# Altium schematic sheet booster_Circuit.SchDoc
size A; SheetNumber: 3; SheetTotal: 7
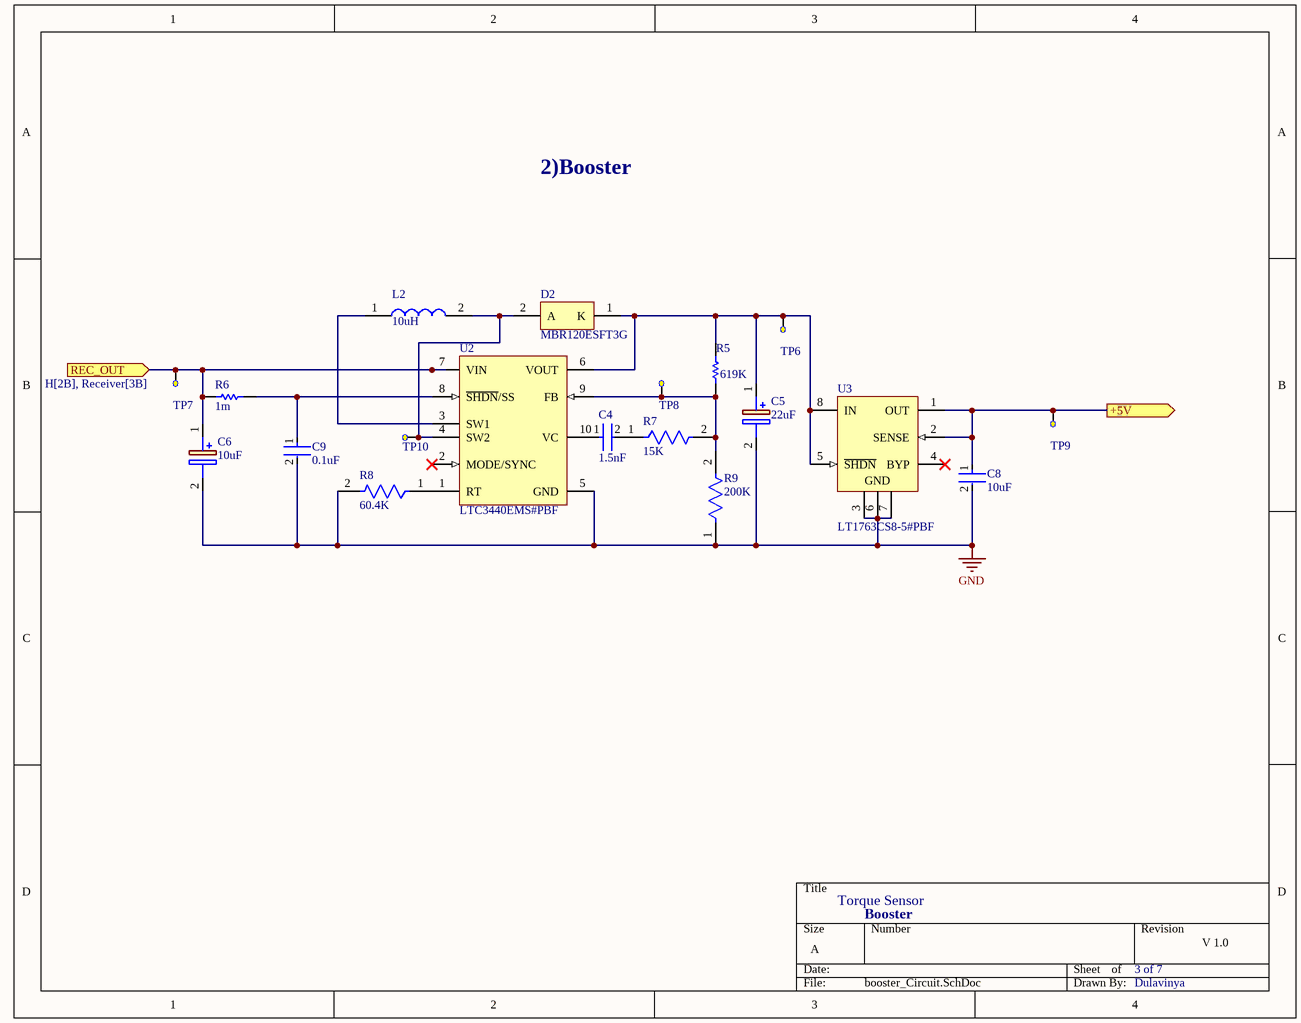
[diagram p0: booster_Circuit.SchDoc]

## Parts
C4  1.5nF  [FP-CC0402-MFG]
C5  22uF  [EEE1AA220WR]
C6  10uF  [EEE1AA220WR]
C8  10uF  [FP-GRM155-0_05-MFG]
C9  0.1uF  [FP-GRM155-0_05-MFG]
D2  MBR120ESFT3G  [ONSC-SOD-123FL-2-498_V]
L2  10uH  [INDM6552X200N]
R5  619K  [RESC1005X40X25ML05T05]
R6  1m  [RESC2013X60X35ML10T20]
R7  15K  [FP-RT0402-MFG]
R8  60.4K  [FP-ERJ2RK-MFG]
R9  200K  [FP-RT0402-MFG]
TP6  Test point  [Test_point]  (value not drawn)
TP7  Test point  [Test_point]  (value not drawn)
TP8  Test point  [Test_point]  (value not drawn)
TP9  Test point  [Test_point]  (value not drawn)
TP10  Test point  [Test_point]  (value not drawn)
U2  LTC3440EMS#PBF  [LT-MS-10_M]
U3  LT1763CS8-5#PBF  [LT-S8-8_M]

## Ports
+5V (out, see H[2B], Instrumentation_Amp[2B], MCU_1[1B], Offset[2B]), REC_OUT (in, see H[2B], Receiver[3B])

## Nets
GND: C5.2(-) C6.2(-) C8.2 C9.2 R8.2 R9.1 U2.5(GND) U3.3(GND) U3.6(GND) U3.7(GND)
+5V: C8.1 TP9.TP?(Test_point) U3.1(OUT) U3.2(SENSE) ; port +5V
REC_OUT: C6.1(+) R6.1 TP7.TP?(Test_point) U2.7(VIN) ; port REC_OUT
NetC4_1: C4.1 U2.10(VC)
NetC4_2: C4.2 R7.1
NetC5_1: C5.1(+) D2.1(K) R5.2 TP6.TP?(Test_point) U2.6(VOUT) U3.5(~{SHDN}) U3.8(IN)
NetC9_1: C9.1 R6.2 U2.8(~{SHDN}/SS)
NetD2_2: D2.2(A) L2.2 TP10.TP?(Test_point) U2.4(SW2)
NetL2_1: L2.1 U2.3(SW1)
NetR5_1: R5.1 R7.2 R9.2 TP8.TP?(Test_point) U2.9(FB)
NetR8_1: R8.1 U2.1(RT)

Not connected (* = marked no-connect by the designer): U2 2(MODE/SYNC)*; U3 4(BYP)*

## Notes on the sheet
- 2)Booster
- Torque Sensor
- Booster
- 3 of 7
- V 1.0
- Dulavinya

## Library data of the parts
C4 = CMP-03422-001237-1: CAP CER 1500PF 50V X7R 0402; Manufacturer: YAGEO; Manufacturer Part Number: CC0402KRX7R9BB152; Automotive Grade: NA; Temperature Coefficient: 30ppm/°C; Material: Ceramic; Tolerance: 0.1; Device Class L1: Passive Components; Temperature Range Low: -55°C; Digikey Description: CAP CER 1500PF 50V X7R 0402; Voltage Rating: 50 V; Temperature Range High: +125°C; Value: 1.5 nF; Ipc Land Pattern Name: CAPC10050X50; Footprint Url: http://www.yageo.com/exep/pages/download/literatures/UPY-C_GEN_24.pdf; RoHS: TRUE; Device Class L2: Capacitors; Height: 0.55mm; ComponentLink2Description: Datasheet; Mouser Description: Multilayer Ceramic Capacitors MLCC - SMD/SMT 1.5nF 50V X7R 10%; Octopart: https://octopart.com/cc0402krx7r9bb152-yageo-40952070; Temperature Characteristic: X7R; Temperature: -55°C to +125°C; Device Class L3: Ceramic Capacitors; Package: CC0402; ComponentLink2URL: http://www.yageo.com/documents/recent/UPY-GP_NP0_16V-to-50V_16.pdf; Capacitance: 1.5 nF; Automotive: No; Category: Cap; Lead Free: Yes
C5 C6 = EEE-FN1E220R: Capacitor Polarised; Manufacturer_Name: Panasonic; Datasheet Link: http://industrial.panasonic.com/cdbs/www-data/pdf/RDE0000/RDE0000C1259.pdf; Height: 5.5mm; Manufacturer_Part_Number: EEE-FN1E220R; Mouser Part Number: 667-EEE-FN1E220R; Mouser Price/Stock: https://www.mouser.co.uk/ProductDetail/Panasonic/EEE-FN1E220R?qs=OlC7AqGiEDmsrQfqs6SjTg%3D%3D
C8 C9 = CMP-2008-03928-2: NexarPartId: 9223238; Manufacturer Lifecycle Status: NRND; Voltage: 16V; Tolerance: 10%; Dielectric: X7R; Material: Ceramic; Capacitance: 100nF; Schedule B: 8532240020, 8532240020; Mount: Surface Mount; Case/Package: 0402; Case Code (Imperial): 0402; Min Operating Temperature: -55°C; Length: 1mm; Voltage Rating (DC): 16V; Depth: 500µm; Lead Free: Lead Free; Max Operating Temperature: 125°C; Case Code (Metric): 1005; Radiation Hardening: No; Height: 550µm; Voltage Rating: 16V; Packaging: Cut Tape; RoHS: Compliant; Width: 500µm; Number of Pins: 2; REACH SVHC: No SVHC; Termination: SMD/SMT; Thickness: 500µm
D2 = CMP-1055-00436-1: Schottky Power Rectifier, 2-Pin SOD-123, Pb-Free, Tape and Reel; Manufacturer: On Semiconductor; Configuration: Single; IFSM Max (A): 40; DatasheetVersion: Rev. 4; ComponentLink3URL: http://www.onsemi.com/pub_link/Collateral/498-01.PDF; Packing: Tape and Reel; PackageVersion: Rev. D, 05/2013; ComponentLink3Description: Package Specification; Mounting Technology: Surface Mount; ComponentLink2Description: Datasheet; PackageDescription: 2-Pin SOD, Body 1.65 x 2.7 mm; ComponentLink1Description: Manufacturer URL; ComponentLink2URL: http://www.onsemi.cn/pub_link/Collateral/MBR120ESFT1-D.PDF; ComponentLink1URL: http://www.onsemi.com/; PartNumber: MBR120ESFT3G; PackageReference: SOD-123FL-2-498; RoHS: TRUE
L2 = DO1606T-103MLC: Inductor; Manufacturer_Name: COILCRAFT; Datasheet Link: https://componentsearchengine.com/Datasheets/1/DO1606T-103MLC.pdf; Height: 2mm; Manufacturer_Part_Number: DO1606T-103MLC; Mouser Part Number: 994-DO1606T-103MLC; Mouser Price/Stock: https://www.mouser.co.uk/ProductDetail/Coilcraft/DO1606T-103MLC?qs=ZYnrCdKdyefGdFkruljUUQ%3D%3D
R5 = CMP-2002-01017-1: Part Number: ERJ-2RKF6193X; Manufacturer: Panasonic
R6 = CMP-2100-03671-1: Chip Resistor, 1 KOhm, +/- 1%, 125 mW, -55 to 155 degC, 0805 (2012 Metric), RoHS, Tape and Reel; Manufacturer: Yageo; Temperature Coefficient: 100ppm/degreesC; Voltage Rating (DC): 150V; Max Power Dissipation: 125mW; Resistance: 1KOhm; Number of Pins: 2; Number of Terminations: 2; Datasheet URL: http://www.yageo.com/NewPortal/yageodocoutput?fileName=/pdf/R-Chip/PYu-RC_Group_51_RoHS_L_5.pdf; Length: 0.079inch; Package Description: 2-Pin Surface Mounted Device, Body 2 x 1.25 mm; Depth: 1.25mm; Height: 0.024inch; Military Standard: Not; Case/Package: 0805; Package Reference: 0805; RoHSCompliant: true; Lead Free: LeadFree; Packaging: TapeandReel; Package Quantity: 1; Datasheet Version: Rev. 5, 10/2016; Tolerance: 1%; Min Operating Temperature: -55degC; Voltage Rating: 150V; Composition: ThickFilm; Case Code (Imperial): 0805; Power Rating: 125mW; Width: 0.049inch; Case Code (Metric): 2012; Manufacturer URL: http://www.yageo.com/; Max Operating Temperature: 155degC; REACH SVHC: Unknown; Termination: SMD/SMT
R7 = CMP-2002-02672-2: RES 15.0K OHM 1/16W .1% SMD 0402; Manufacturer: Yageo; Manufacturer Part Number: RT0402BRE0715KL; Resistance: 15KΩ; Temperature Coefficient: 50 ppm/°C; Voltage Rating: 50V; Power Rating: 0.063W; Tolerance: 0.001; Value: 15KΩ; ComponentLink2Description: Datasheet; Series: RT; Composition: Thin Film; Automotive: No; Package: RT0402; Octopart: https://octopart.com/rt0402bre0715kl-yageo-1259318; Lead Free: Yes; Mouser Description: Thin Film Resistors 1/16W 15K ohm .1% 50ppm; Height: 0.35mm; Category: Res; ComponentLink2URL: http://www.yageo.com/documents/recent/PYu-RT_1-to-0.01_RoHS_L_9.pdf; Ipc Land Pattern Name: RESC10050X30; Device Class L2: Resistors; Device Class L3: Chip SMD Resistors; RoHS: TRUE; Footprint Url: http://www.yageo.com/exep/pages/download/literatures/PYu-R_Mount_10.pdf; Device Class L1: Passive Components; Digikey Description: RES 15.0K OHM 1/16W .1% SMD 0402; Temperature Range Low: -55°C; Temperature: -55°C to +155°C; Temperature Range High: +155°C
R8 = CMP-2002-01011-2: RES SMD 60.4K OHM 1% 1/10W 0402; Resistance: 60.4kR; Voltage Rating: 50V; Power Rating: 100mW; Temperature Coefficient: 100ppm/°C; Length: 1mm; Weight: 2.8E-05oz; Min Operating Temperature: -55°C; Packaging: Cut Tape; Technology: THICK FILM; Case Code (Metric): 1005; Mount: Surface Mount; Height: 0.35mm; Termination: SMD/SMT; Contact Plating: Tin; RoHS Compliant: Yes; Series: ERJ-2Rx; Military Standard: Not; Number of Terminations: 2; Features: Automotive AEC-Q200; Voltage Rating (DC): 50V; Resistor Type: Thick Film; Tolerance: 1%; Package Quantity: 10000; Depth: 0.5mm; Case/Package: 0402; Max Power Dissipation: 100mW; REACH SVHC: No SVHC; Width: 0.5mm; Max Operating Temperature: 155°C; Case Code (Imperial): 0402
R9 = CMP-03412-025742-1: RES SMD 200K OHM 0.1% 1/16W 0402; Manufacturer: Yageo; Manufacturer Part Number: RT0402BRD07200KL; Tolerance: 0.001; Resistance: 200KΩ; Value: 200KΩ; Voltage Rating: 50V; Power Rating: 0.063W; Temperature Coefficient: 25 ppm/°C; Temperature: -55°C to +155°C; RoHS: TRUE; Series: RT; ComponentLink2Description: Datasheet; Automotive: No; Footprint Url: http://www.yageo.com/exep/pages/download/literatures/PYu-R_Mount_10.pdf; Temperature Range Low: -55°C; Ipc Land Pattern Name: RESC10050X30; Device Class L3: Chip SMD Resistors; Category: Res; Composition: Thin Film; Digikey Description: RES SMD 200K OHM 0.1% 1/16W 0402; Temperature Range High: +155°C; Device Class L2: Resistors; Octopart: https://octopart.com/rt0402brd07200kl-yageo-71392655; Lead Free: Yes; Height: 0.35mm; ComponentLink2URL: http://www.yageo.com/documents/recent/PYu-RT_1-to-0.01_RoHS_L_9.pdf; Device Class L1: Passive Components; Package: RT0402
TP6-TP10 = test_point: Value: Test point
U2 = CMP-0492-01290-1: Micropower Synchronous Buck-Boost DC/DC Converter, 10-pin SOP (MS-10), -40 to 85 degC, Pb-Free; Manufacturer: Linear Technology; Frequency Sync Range: 300kHz - 2MHz; Number of Outputs: 1; DatasheetVersion: Rev. B; PackageVersion: Rev. E, 06/2010; ComponentLink2Description: Datasheet; ComponentLink1URL: http://www.linear.com/; ComponentLink3URL: http://cds.linear.com/docs/en/packaging/05081661_F_MS.pdf; PackageDescription: 10-Pin Plastic MSOP, Body 3 x 3 mm, Pitch 0.5 mm; ComponentLink1Description: Manufacturer URL; Mounting Technology: Surface Mount; RoHS: TRUE; ComponentLink3Description: Package Specification; ComponentLink2URL: http://cds.linear.com/docs/en/datasheet/3440fb.pdf; PartNumber: LTC3440EMS#PBF; PackageReference: MS-10
U3 = CMP-0476-01685-1: 500 mA, Low Noise, LDO Micropower Regulator, 1.8 to 20 V Vin, 5 V Vout, 8-pin SOIC (S8-8), -40 to 125 degC, Pb-Free; Manufacturer: Linear Technology; Output Voltage: 5 V; Vin Min(V): 1.8; Discrete Pass Element: no; Number of Outputs: 1; Dropout Voltage(V): 0.3; Vin Max(V): 20; PSRR(dB): 65; Iout(mA): 500; Isupply(mA): 0.03; Mounting Technology: Surface Mount; ComponentLink3Description: Package Specification; PartNumber: LT1763CS8-5#PBF; PackageDescription: 8-Pin Plastic Small Outline (Narrow .150 Inch), Body 4.9 x 3.9 mm, Pitch 1.27 mm; DatasheetVersion: Rev. G; ComponentLink2URL: http://cds.linear.com/docs/en/datasheet/1763fg.pdf; PackageReference: S8-8; ComponentLink1URL: http://www.linear.com/; ComponentLink2Description: Datasheet; ComponentLink1Description: Manufacturer URL; PackageVersion: Rev. G, 03/2012; Shutdown Current(uA): 1; ComponentLink3URL: http://cds.linear.com/docs/en/packaging/05081610_G_SO8.pdf; RoHS: TRUE; Noise(uV): 20